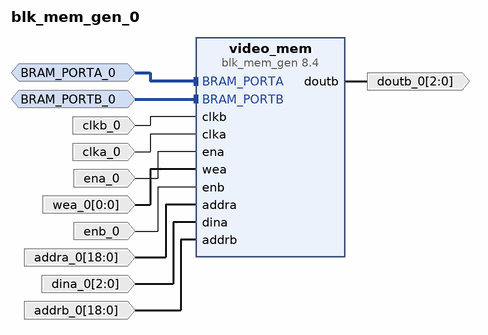
[diagram p0: block diagram of the top level]
# Vivado block design blk_mem_gen_0, xc7z010clg400-1, Vivado 2018.2
create_bd_design blk_mem_gen_0

create_bd_intf_port -mode Slave -vlnv xilinx.com:interface:bram_rtl:1.0 BRAM_PORTA_0
create_bd_intf_port -mode Slave -vlnv xilinx.com:interface:bram_rtl:1.0 BRAM_PORTB_0
create_bd_port -dir I -type clk clkb_0
create_bd_port -dir I -type clk clka_0
create_bd_port -dir I ena_0
create_bd_port -dir I -from 0 -to 0 wea_0
create_bd_port -dir I enb_0
create_bd_port -dir I -from 18 -to 0 addra_0
create_bd_port -dir I -from 2 -to 0 dina_0
create_bd_port -dir I -from 18 -to 0 addrb_0
create_bd_port -dir O -from 2 -to 0 doutb_0

create_bd_cell -type ip -vlnv xilinx.com:ip:blk_mem_gen:8.4 video_mem
set_property -dict [list \
  CONFIG.Memory_Type Simple_Dual_Port_RAM \
  CONFIG.Enable_32bit_Address false \
  CONFIG.Use_Byte_Write_Enable false \
  CONFIG.Write_Width_A 3 \
  CONFIG.Write_Depth_A 307200 \
  CONFIG.Operating_Mode_A NO_CHANGE \
  CONFIG.Write_Width_B 3 \
  CONFIG.Read_Width_B 3 \
  CONFIG.Enable_B Use_ENB_Pin \
  CONFIG.Register_PortB_Output_of_Memory_Primitives true \
  CONFIG.Port_B_Clock 100 \
  CONFIG.Port_B_Enable_Rate 100 \
  CONFIG.use_bram_block Stand_Alone \
] [get_bd_cells video_mem]

# ---- connections ----

connect_bd_intf_net -intf_net BRAM_PORTA_0_1 [get_bd_intf_ports BRAM_PORTA_0] [get_bd_intf_pins video_mem/BRAM_PORTA]
connect_bd_intf_net -intf_net BRAM_PORTB_0_1 [get_bd_intf_ports BRAM_PORTB_0] [get_bd_intf_pins video_mem/BRAM_PORTB]
connect_bd_net -net clkb_0_1 [get_bd_ports clkb_0] [get_bd_pins video_mem/clkb]
connect_bd_net -net clka_0_1 [get_bd_ports clka_0] [get_bd_pins video_mem/clka]
connect_bd_net -net ena_0_1 [get_bd_ports ena_0] [get_bd_pins video_mem/ena]
connect_bd_net -net wea_0_1 [get_bd_ports wea_0] [get_bd_pins video_mem/wea]
connect_bd_net -net enb_0_1 [get_bd_ports enb_0] [get_bd_pins video_mem/enb]
connect_bd_net -net addra_0_1 [get_bd_ports addra_0] [get_bd_pins video_mem/addra]
connect_bd_net -net dina_0_1 [get_bd_ports dina_0] [get_bd_pins video_mem/dina]
connect_bd_net -net addrb_0_1 [get_bd_ports addrb_0] [get_bd_pins video_mem/addrb]
connect_bd_net -net blk_mem_gen_0_doutb [get_bd_pins video_mem/doutb] [get_bd_ports doutb_0]

validate_bd_design
save_bd_design
